# EAGLE schematic output_board (EAGLE 7.6.0)
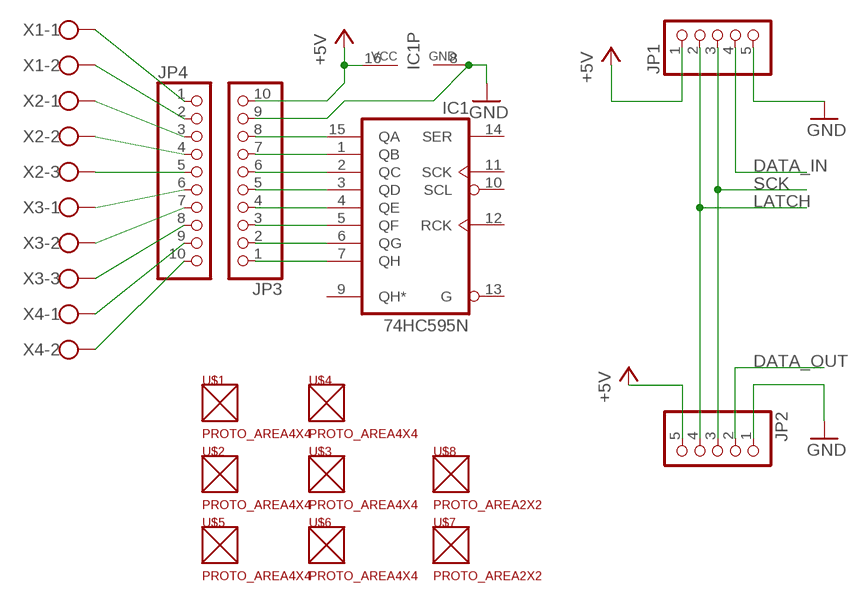
[diagram p0: schematic, sheet 1]

## Parts
IC1  74HC595N  [DIL16]
JP1  PINHD-1X5  [1X05]
JP2  PINHD-1X5  [1X05]
JP3  PINHD-1X10  [1X10]
JP4  PINHD-1X10  [1X10]
U$1  PROTO_AREA4X4  [PROTO4X4]
U$2  PROTO_AREA4X4  [PROTO4X4]
U$3  PROTO_AREA4X4  [PROTO4X4]
U$4  PROTO_AREA4X4  [PROTO4X4]
U$5  PROTO_AREA4X4  [PROTO4X4]
U$6  PROTO_AREA4X4  [PROTO4X4]
U$7  PROTO_AREA2X2  [PROTO2X2]
U$8  PROTO_AREA2X2  [PROTO2X2]
X1  W237-102  [W237-102]
X2  W237-103  [W237-103]
X3  W237-103  [W237-103]
X4  W237-102  [W237-102]

## Nets
+5V: IC1.16(VCC) JP1.1 JP2.5 JP3.10
DATA_IN: JP1.4
DATA_OUT: JP2.2
GND: IC1.8(GND) JP1.5 JP2.1 JP3.9
LATCH: JP1.2 JP2.4
N$1: IC1.7(QH) JP3.1
N$2: IC1.6(QG) JP3.2
N$3: IC1.5(QF) JP3.3
N$4: IC1.4(QE) JP3.4
N$5: IC1.3(QD) JP3.5
N$6: IC1.2(QC) JP3.6
N$7: IC1.1(QB) JP3.7
N$8: IC1.15(QA) JP3.8
N$10: JP4.1 X1.1
N$11: JP4.2 X1.2
N$12: JP4.3 X2.1
N$13: JP4.4 X2.2
N$14: JP4.5 X2.3
N$15: JP4.6 X3.1
N$16: JP4.7 X3.2
N$17: JP4.8 X3.3
N$18: JP4.9 X4.1
N$19: JP4.10 X4.2
SCK: JP1.3 JP2.3
Unconnected: IC1.9(QH*) IC1.10(SCL) IC1.11(SCK) IC1.12(RCK) IC1.13(G) IC1.14(SER)

## Library data of the parts
IC1 = 74xx-eu:74*595: 8-bit SHIFT REGISTER, output latch
JP1 JP2 = pinhead:PINHD-1X5: PIN HEADER
JP3 JP4 = pinhead:PINHD-1X10: PIN HEADER
U$1-U$8 = Custom:PROTO_AREA
X1 X4 = con-wago-500:W237-102: WAGO SCREW CLAMP; MPN: 237-102; OC_FARNELL: unknown; OC_NEWARK: 70K9898
X2 X3 = con-wago-500:W237-103: WAGO SCREW CLAMP; MPN: 237-103; OC_FARNELL: unknown; OC_NEWARK: 18M7116